# EAGLE design akabeacon_circle_MDBT40 (EAGLE 7.4.0)
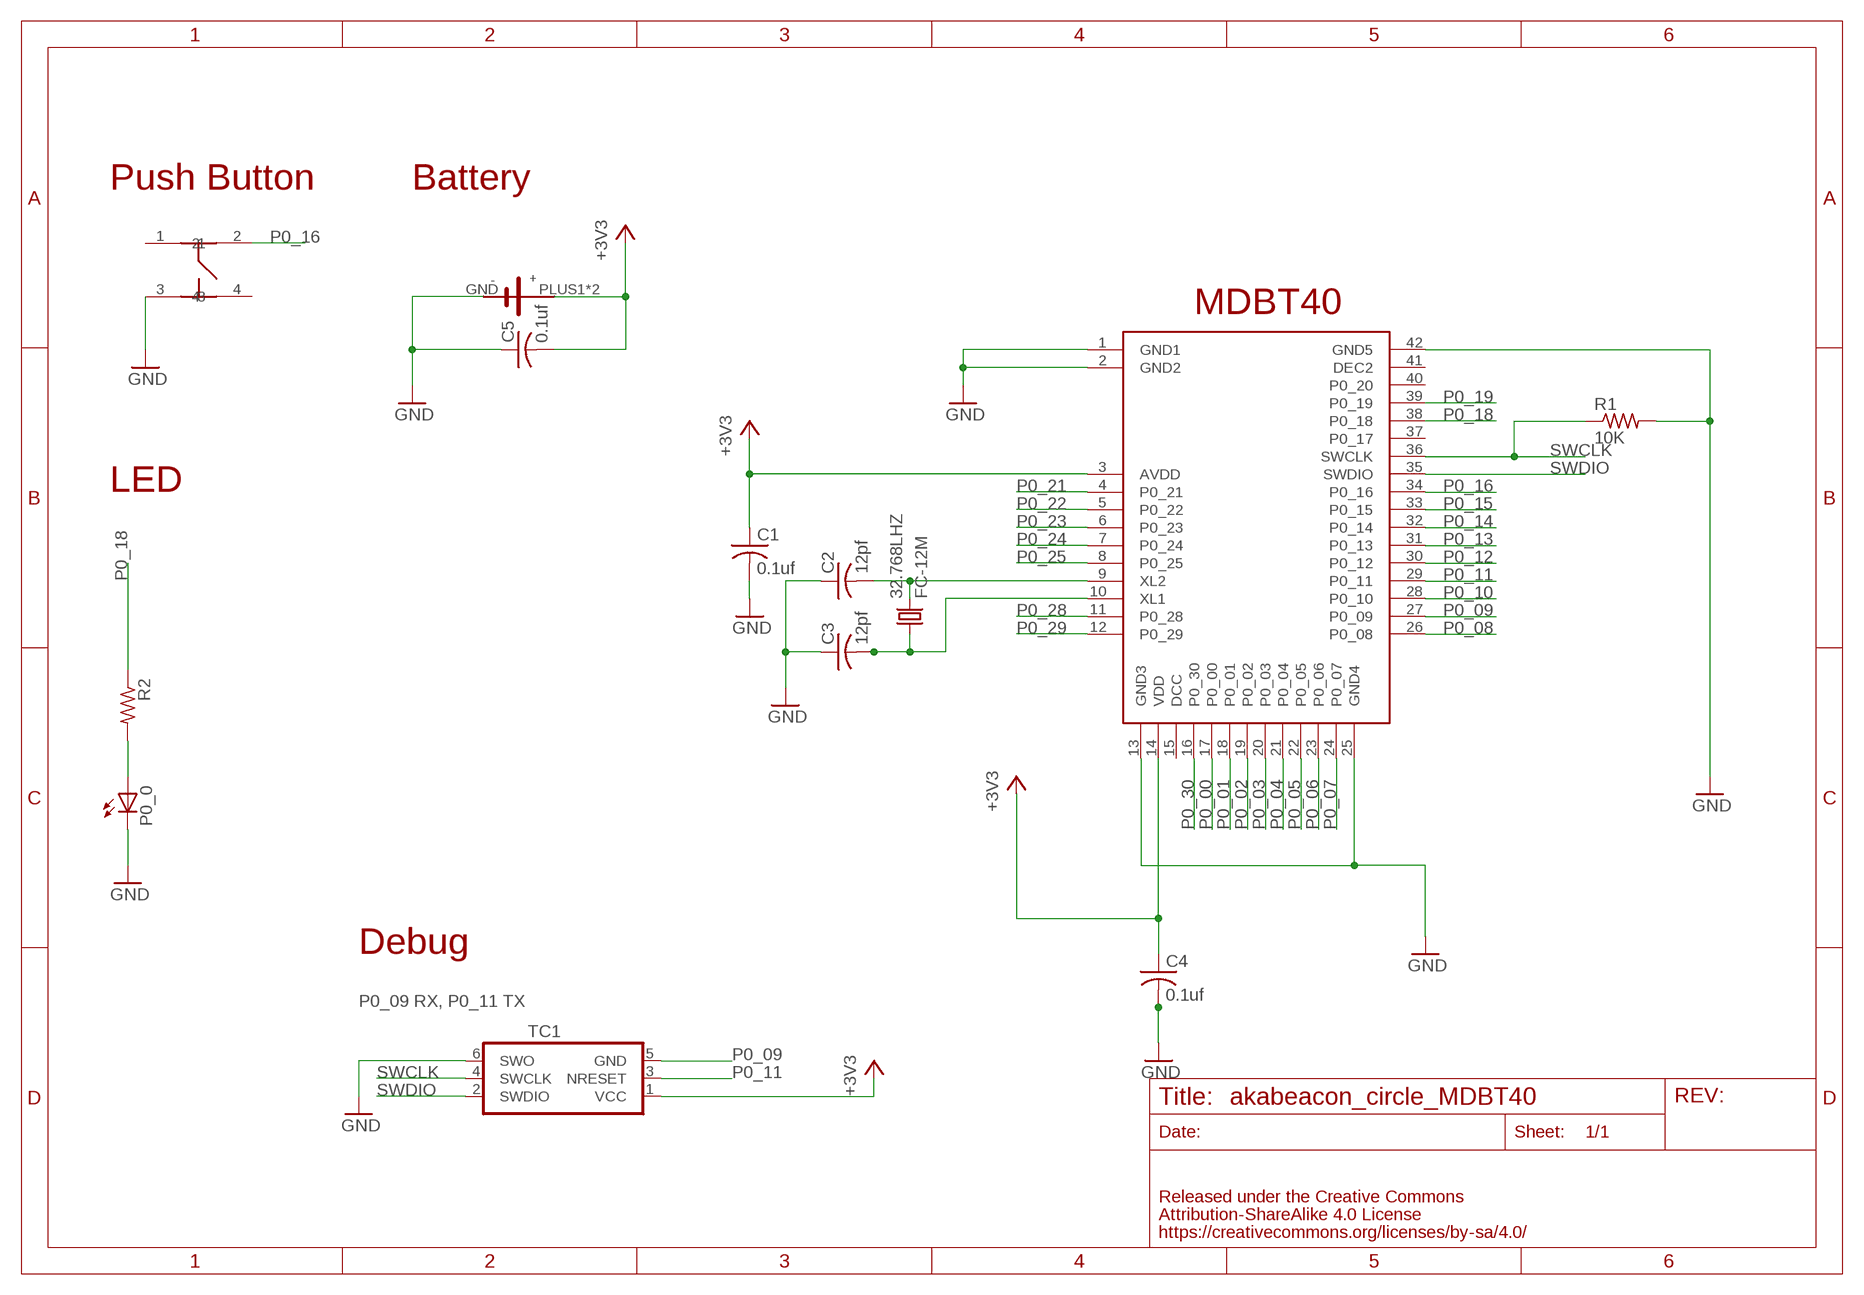
[diagram p0: schematic, sheet 1]

## Parts
32.768LHZ  FC-12M  [FC-12M]
C1  0.1uf  C-USC0603  [C0603]
C2  12pf  C-USC0603  [C0603]
C3  12pf  C-USC0603  [C0603]
C4  0.1uf  C-USC0603  [C0603]
C5  0.1uf  C-USC0603  [C0603]
P0_0  LEDCHIP-LED0603  [CHIP-LED0603]
R1  10K  R-US_R0603  [R0603]
R2  R-US_R0603  [R0603]
TC1  TC2030-IDC-NL  [TC2030-IDC-NL]
U$1  RAYTAC-MDBT40  [RAYTAC-MDBT40]
U$5  SWICTH-4P(KMR2)  [SWITCH-4P(KMR2)]
U$7  CIRCLE-TYPE1  [CIRCLE-TYE1-TC2030]

## Nets
+3V3: C1.1 C4.1 C5.2 TC1.1(VCC) U$1.3(AVDD) U$1.14(VDD) U$7.PLUS1(VCC) U$7.PLUS2(VCC)
GND: C1.2 C2.1 C3.1 C4.2 C5.1 P0_0.C R1.2 TC1.6(SWO) U$1.1(GND1) U$1.2(GND2) U$1.13(GND3) U$1.25(GND4) U$1.42(GND5) U$5.3 U$7.GND
N$1: P0_0.A R2.2
N$7: 32.768LHZ.2 C2.2 U$1.9(XL2)
N$8: 32.768LHZ.1 C3.2 U$1.10(XL1)
P0_00: U$1.17(P0_00)
P0_01: U$1.18(P0_01)
P0_02: U$1.19(P0_02)
P0_03: U$1.20(P0_03)
P0_04: U$1.21(P0_04)
P0_05: U$1.22(P0_05)
P0_06: U$1.23(P0_06)
P0_07: U$1.24(P0_07)
P0_08: U$1.26(P0_08)
P0_09: TC1.5(GND) U$1.27(P0_09)
P0_10: U$1.28(P0_10)
P0_11: TC1.3(NRESET) U$1.29(P0_11)
P0_12: U$1.30(P0_12)
P0_13: U$1.31(P0_13)
P0_14: U$1.32(P0_14)
P0_15: U$1.33(P0_15)
P0_16: U$1.34(P0_16) U$5.2
P0_18: R2.1 U$1.38(P0_18)
P0_19: U$1.39(P0_19)
P0_21: U$1.4(P0_21)
P0_22: U$1.5(P0_22)
P0_23: U$1.6(P0_23)
P0_24: U$1.7(P0_24)
P0_25: U$1.8(P0_25)
P0_28: U$1.11(P0_28)
P0_29: U$1.12(P0_29)
P0_30: U$1.16(P0_30)
SWCLK: R1.1 TC1.4(SWCLK) U$1.36(SWCLK)
SWDIO: TC1.2(SWDIO) U$1.35(SWDIO)
Unconnected: U$1.15(DCC) U$1.37(P0_17) U$1.40(P0_20) U$1.41(DEC2) U$5.1 U$5.4

## Notes on the sheet
- Push Button | Battery
- MDBT40
- LED
- Debug
- P0_09 RX, P0_11 TX

## Library data of the parts
32.768LHZ = crystal:FC-12M: kHz RANGE CRYSTAL UNIT LOW PROFILE SMD Source: Epson Toyocom FC-12M.pdf
C1-C5 = adafruit:C-US: CAPACITOR, American symbol
P0_0 = led:LED: LED OSRAM: - CHIPLED LG R971, LG N971, LY N971, LG Q971, LY Q971, LO R971, LY R971 LH N974, LH R974 LS Q976, LO Q976, LY Q976 LO Q996 - Hyper CHIPLED LW Q18S LB Q993, LB Q99A, LB R99A - SideLED LS A670, LO A670, LY A670, LG A670, LP A670 LB A673, LV A673, LT A673, LW A673 LH A674 LY A675 LS A676, LA A676, LO A676, LY A676, LW A676 LS A679, LY A679, LG A679 - Hyper Micro SIDELED® LS Y876, LA Y876, LO Y876, LY Y876 LT Y87S - SmartLED LW L88C, LW L88S LB L89C, LB L89S, LG L890 LS L89K, LO L89K, LY L89K LS L896, LA L896, LO L896, LY L896 - TOPLED LS T670, LO T670, LY T670, LG T670, LP T670 LSG T670, LSP T670, LSY T670, LOP T670, LYG T670 LG T671, LOG T671, LSG T671 LB T673, LV T673, LT T673, LW T673 LH T674 LS T676, LA T676, LO T676, LY T676, LB T676, LH T676, LSB T676, LW T676 LB T67C, LV T67C, LT T67C, LS T67K, LO T67K, LY T67K, LW E67C LS E67B, LA E67B, LO E67B, LY E67B, LB E67C, LV E67C, LT E67C LW T67C LS T679, LY T679, LG T679 LS T770, LO T770, LY T770, LG T770, LP T770 LB T773, LV T773, LT T773, LW T773 LH T774 LS E675, LA E675, LY E675, LS T675 LS T776, LA T776, LO T776, LY T776, LB T776 LHGB T686 LT T68C, LB T68C - Hyper Mini TOPLED® LB M676 - Mini TOPLED Santana® LG M470 LS M47K, LO M47K, LY M47K Source: http://www.osram.convergy.de LUXEON: - LUMILED® LXK2-PW12-R00, LXK2-PW12-S00, LXK2-PW14-U00, LXK2-PW14-V00 LXK2-PM12-R00, LXK2-PM12-S00, LXK2-PM14-U00 LXK2-PE12-Q00, LXK2-PE12-R00, LXK2-PE12-S00, LXK2-PE14-T00, LXK2-PE14-U00 LXK2-PB12-K00, LXK2-PB12-L00, LXK2-PB12-M00, LXK2-PB14-N00, LXK2-PB14-P00, LXK2-PB14-Q00 LXK2-PR12-L00, LXK2-PR12-M00, LXK2-PR14-Q00, LXK2-PR14-R00 LXK2-PD12-Q00, LXK2-PD12-R00, LXK2-PD12-S00 LXK2-PH12-R00, LXK2-PH12-S00 LXK2-PL12-P00, LXK2-PL12-Q00, LXK2-PL12-R00 Source: www.luxeon.com KINGBRIGHT: KA-3528ASYC Source: www.kingbright.com
R1 R2 = adafruit:R-US_: RESISTOR, American symbol
TC1 = TagConnect:TC2030-IDC: Tag-Connect In Circuit Programming & Debug Cable 6 Pin http://www.tag-connect.com
U$1 = gclueBT:RAYTAC-MDBT40
U$5 = gclue-test:SWICTH-4P(KMR2)
U$7 = GClue-Beacon:CIRCLE-TYPE1

## Board
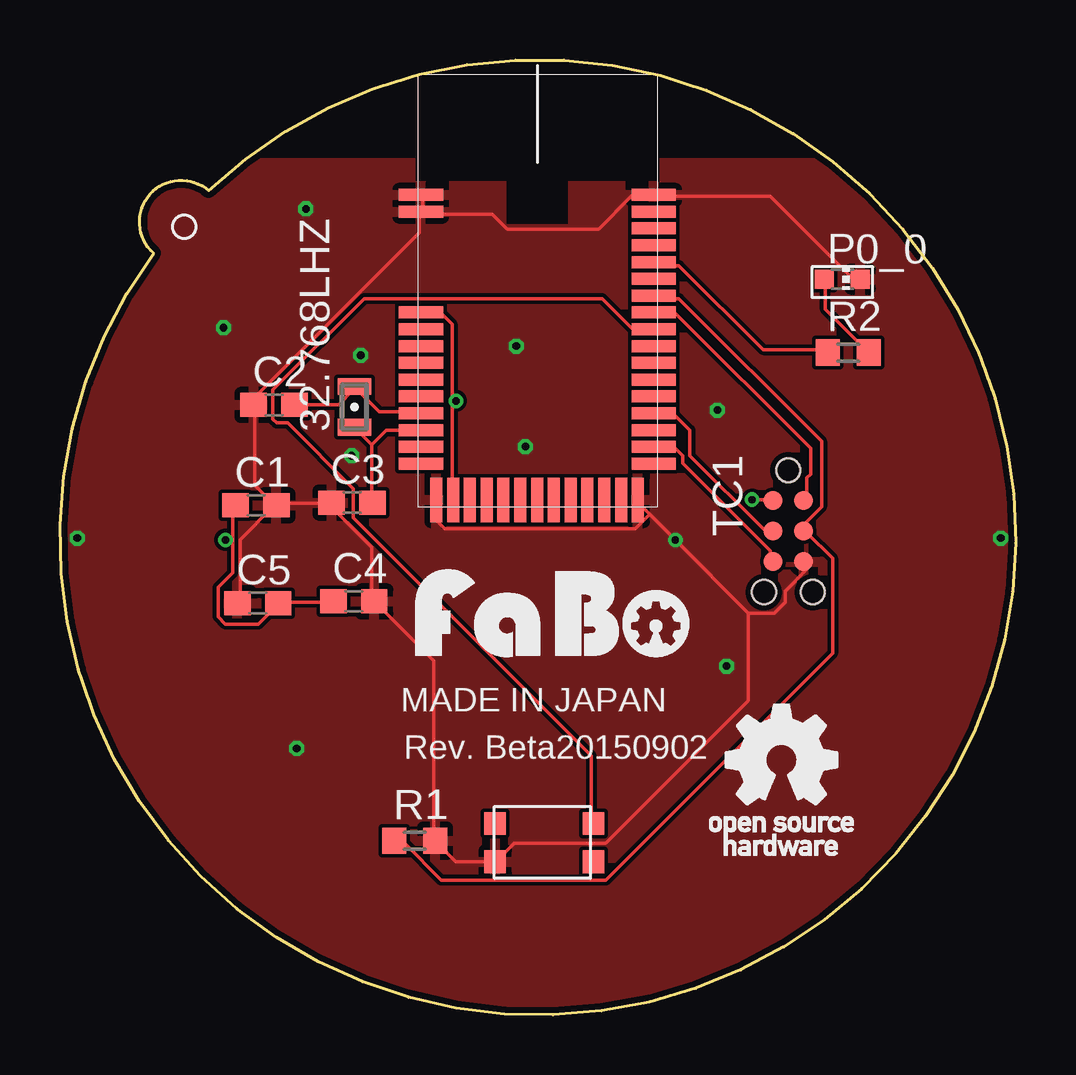
[diagram p1: board, top side]
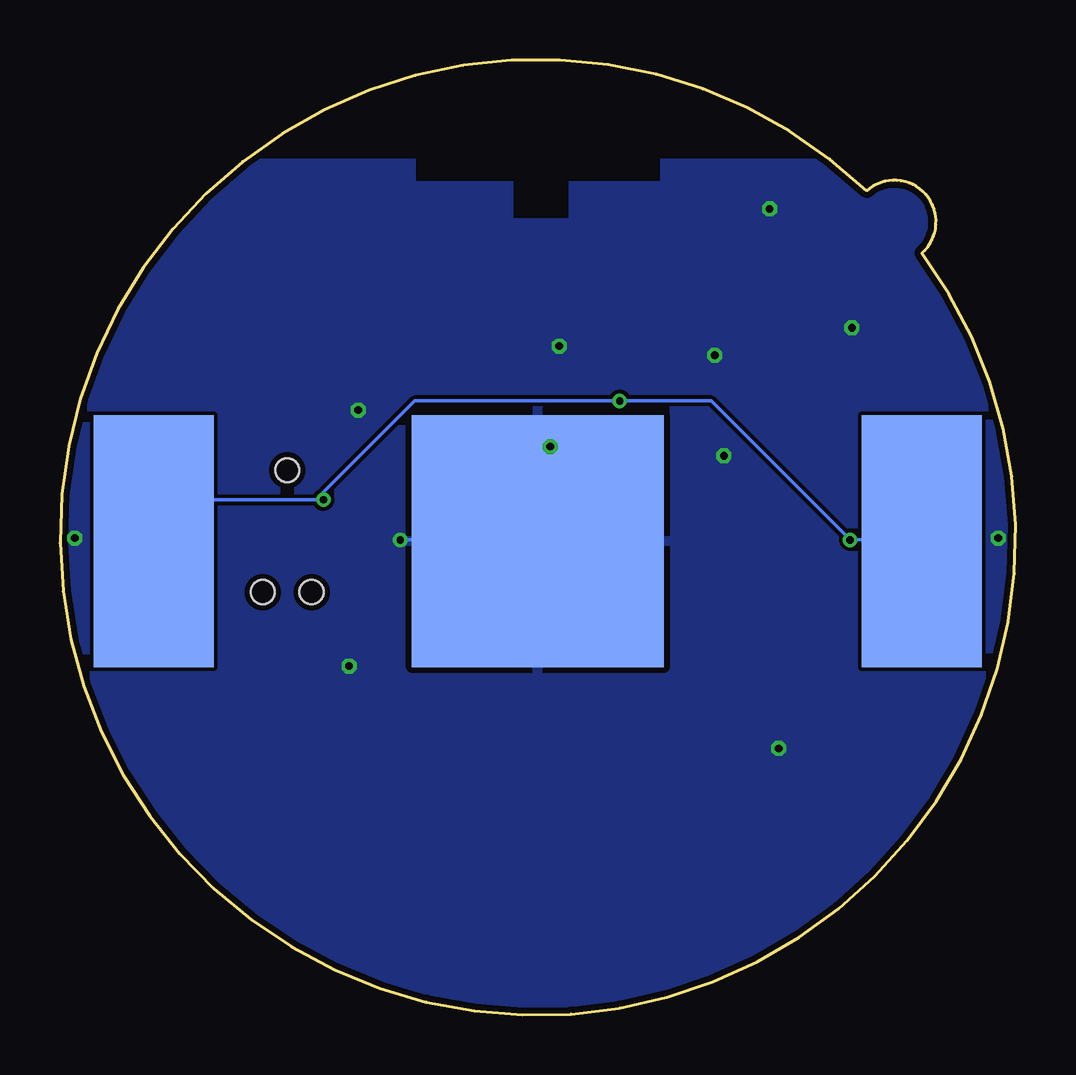
[diagram p2: board, bottom side, seen from below]

Size 39.81 x 39.79 mm. Coordinates in mm from the lower left corner, seen from the top.
Copper layers (1*16): Top 0.035mm / dielectric 1.5mm / Bottom 0.035mm
Design rules "SeeedStudio_2layer_DRU_no_angle_20140221": minimum track width 6mil, minimum drill 12mil, track to track 6mil, track to pad 6mil, pad to pad 6mil, via to via 6mil, smd to smd 0mil, copper to edge 10mil, drill to drill 10mil, minimum pad ring 10mil, minimum via ring 6mil, stop-mask expansion 2mil, vias tented up to drill 100mil, thermal gap 10mil
tRestrict: area 14.8,34.8 to 25,39.3; area 18.6,33 to 21.2,36
bRestrict: area 14.8,34.8 to 25,39.3; area 18.6,33.2 to 20.9,36.3

### Footprints (pad centres in the part's own frame; a part is rotated, then mirrored left to right if it is on the bottom)
FC-12M = smd 0.7 x 1.4: 1 -0.85,0; 2 0.85,0
C0603 = smd 1.1 x 1: 1 -0.85,0; 2 0.85,0
CHIP-LED0603 = smd 0.8 x 0.8: A 0,-0.75; C 0,0.75
R0603 = smd 1 x 1.1: 1 -0.85,0; 2 0.85,0
TC2030-IDC-NL = smd 0.787 x 0.787: 1 -1.27,-0.635; 2 -1.27,0.635; 3 0,-0.635; 4 0,0.635; 5 1.27,-0.635; 6 1.27,0.635 | hole 0.991: -2.54,0; 2.54,1.016; 2.54,-1.016
RAYTAC-MDBT40 = smd 1.85 x 0.5: 1 -4.86,4; 2 -4.86,3.3; 3 -4.86,-0.9; 4 -4.86,-1.6; 5 -4.86,-2.3; 6 -4.86,-3; 7 -4.86,-3.7; 8 -4.86,-4.4; 9 -4.86,-5.1; 10 -4.86,-5.8; 11 -4.86,-6.5; 12 -4.86,-7.2; 26 4.84,-7.2; 27 4.84,-6.5; 28 4.84,-5.8; 29 4.84,-5.1; 30 4.84,-4.4; 31 4.84,-3.7; 32 4.84,-3; 33 4.84,-2.3; 34 4.84,-1.6; 35 4.84,-0.9; 36 4.84,-0.2; 37 4.84,0.5; 38 4.84,1.2; 39 4.84,1.9; 40 4.84,2.6; 41 4.84,3.3; 42 4.84,4 | smd 0.5 x 1.85: 13 -4.22,-8.71; 14 -3.52,-8.71; 15 -2.82,-8.71; 16 -2.12,-8.71; 17 -1.42,-8.71; 18 -0.72,-8.71; 19 -0.02,-8.71; 20 0.68,-8.71; 21 1.38,-8.71; 22 2.08,-8.71; 23 2.78,-8.71; 24 3.48,-8.71; 25 4.18,-8.71
SWITCH-4P(KMR2) = smd 0.9 x 0.95: 1 -1,0; 2 3.1,0; 3 -1,-1.6; 4 3.1,-1.6
CIRCLE-TYE1-TC2030 = smd 10.5 x 10.5 bottom: GND 0,0 | smd 5 x 10.5 bottom: PLUS1 -16,0; PLUS2 16,0

### Placement (x,y rotation side)
32.768LHZ  12.27,25.34 90 top
C1  8.17,21.23 0 top
C2  8.92,25.42 0 top
C3  12.17,21.35 0 top
C4  12.25,17.23 0 top
C5  8.25,17.16 0 top
P0_0  32.6,30.66 270 top
R1  14.78,7.26 0 top
R2  32.85,27.6 0 top
TC1  30.35,20.16 270 top
U$1  19.9,30.17 0 top
U$2  [LOGO_FABO_M]  20.53,14.92 0 top
U$4  [LOGO_OSHW_T_M]  30.06,10.61 0 top
U$5  19.13,7.98 0 top
U$7  19.9,19.74 0 top

### Tracks (layer width: path | path; a pad name or v marks a point on that pad's centre or on a via)
+3V3  (via drill 0.3)
  Top 0.152: v28.84,21.47 29.6,21.47 TC1.1 | 16.34,25.59 16.34,28.79 15.88,29.24 15.12,29.24 U$1.3 | 16.34,25.59 16.34,21.47 U$1.14 | C4.1 11.31,17.2 9.18,17.2 C5.2 9.03,17.05 8.26,16.29 6.89,16.29 6.59,16.59 6.59,17.81 7.2,18.42 7.2,19.79 | 7.2,19.79 7.2,21.17 C1.1 | v6.89,19.79 7.2,19.79 | v16.49,25.59 16.34,25.59
  Bottom 0.152: U$7.PLUS2 35.85,19.79 34.17,21.47 v28.84,21.47 28.84,21.78 25.03,25.59 v16.49,25.59 12.68,25.59 v6.89,19.79 4,19.79 U$7.PLUS1
GND  (via drill 0.3, 0.32)
  Top 0.152: U$1.2 15.12,33.51 15.12,34.12 U$1.1 | P0_0.C 33.26,30.77 32.95,30.77 29.6,34.12 24.88,34.12 U$1.42 24.72,34.12 23.81,34.12 22.44,32.75 18.63,32.75 18.02,33.36 15.12,33.36 U$1.2 | 28.69,16.75 29.75,16.75 30.21,17.2 30.21,17.66 31.12,18.58 31.12,18.88 TC1.6 | 24.57,20.86 24.11,21.32 U$1.25 | 24.57,20.86 v25.64,19.79 28.69,16.75 | 24.57,20.86 23.96,20.25 16.04,20.25 15.73,20.56 15.73,21.32 U$1.13 | C5.1 7.5,17.2 7.5,19.79 8.87,21.17 C1.2 | 11.16,21.32 9.03,21.32 C1.2 | 11.16,21.32 11.31,21.32 C3.1 11.16,21.32 | 11.16,21.32 12.99,19.49 12.99,17.36 C4.2 13.14,17.2 15.58,14.77 15.58,7.3 R1.2 15.73,7.15 16.49,6.38 18.02,6.38 U$5.3 18.17,6.38 18.93,7.15 22.74,7.15 28.69,13.09 28.69,16.75 | C1.2 8.87,21.32 8.11,22.08 8.11,25.28 C2.1 8.11,25.43 8.11,25.74 14.97,32.6 14.97,33.36 U$1.2
  Bottom 0.152: v25.64,19.79 20,19.79 U$7.GND
  other vias: 6.82,28.63 12.53,27.49 19.01,27.87 19.39,23.68 27.39,25.2 27.77,14.54 9.86,11.11 0.72,19.87 39.2,19.87 10.25,33.59 12.15,23.3
  pour Bottom: -3.09,-1.85 42.25,-1.85 42.25,35.49 -3.09,35.49
  pour Top: -3.09,-1.85 42.25,-1.85 42.25,35.49 -3.47,35.49
N$1
  Top 0.152: P0_0.A 31.89,30.61 31.89,29.4 33.56,27.72 R2.2
N$7
  Top 0.152: C2.2 9.79,25.43 11.62,25.43 12.23,26.04 32.768LHZ.2 12.38,26.04 13.29,25.13 14.97,25.13 U$1.9
N$8
  Top 0.152: 12.99,23.76 12.99,21.47 C3.2 | 12.99,23.76 12.38,24.37 32.768LHZ.1 | 12.99,23.76 13.6,24.37 14.97,24.37 U$1.10
P0_09
  Top 0.152: TC1.5 29.6,19.03 29.6,19.34 25.94,22.99 25.94,23.3 25.64,23.6 24.88,23.6 U$1.27
P0_11
  Top 0.152: TC1.3 29.6,20.25 29.3,20.25 26.25,23.3 26.25,24.37 25.64,24.98 24.88,24.98 U$1.29
P0_16
  Top 0.152: U$5.2 22.13,8.06 22.13,10.8 12.23,20.71 12.23,21.93 9.48,24.67 9.03,24.67 8.87,24.82 8.87,26.04 12.68,29.85 22.59,29.85 23.81,28.63 24.72,28.63 U$1.34
P0_18
  Top 0.152: R2.1 31.89,27.72 29.3,27.72 25.79,31.22 24.88,31.22 U$1.38
SWCLK
  Top 0.152: U$1.36 24.88,29.85 25.79,29.85 31.73,23.91 31.73,21.17 31.12,20.56 31.12,20.25 TC1.4 31.12,20.1 32.19,19.03 32.19,15.07 22.74,5.62 15.88,5.62 14.36,7.15 14.06,7.15 R1.1
SWDIO
  Top 0.152: TC1.2 31.12,21.47 31.12,22.39 31.28,22.54 31.28,23.6 25.64,29.24 24.88,29.24 U$1.35

### Text on the board
tPlace: MADE IN JAPAN | Rev. Beta20150902